# Altium schematic sheet Optical_RX_TX.SchDoc
size A4; CompanyName: Technische Hochschule Nürnberg Georg Simon Ohm; Organization: UltraZohm; Address1: Kesslerplatz 12; Address2: 90489 Nürnberg; Address3: GERMANY; DocumentNumber: 5; SheetNumber: 4; SheetTotal: 5; Website: www.ultrazohm.com
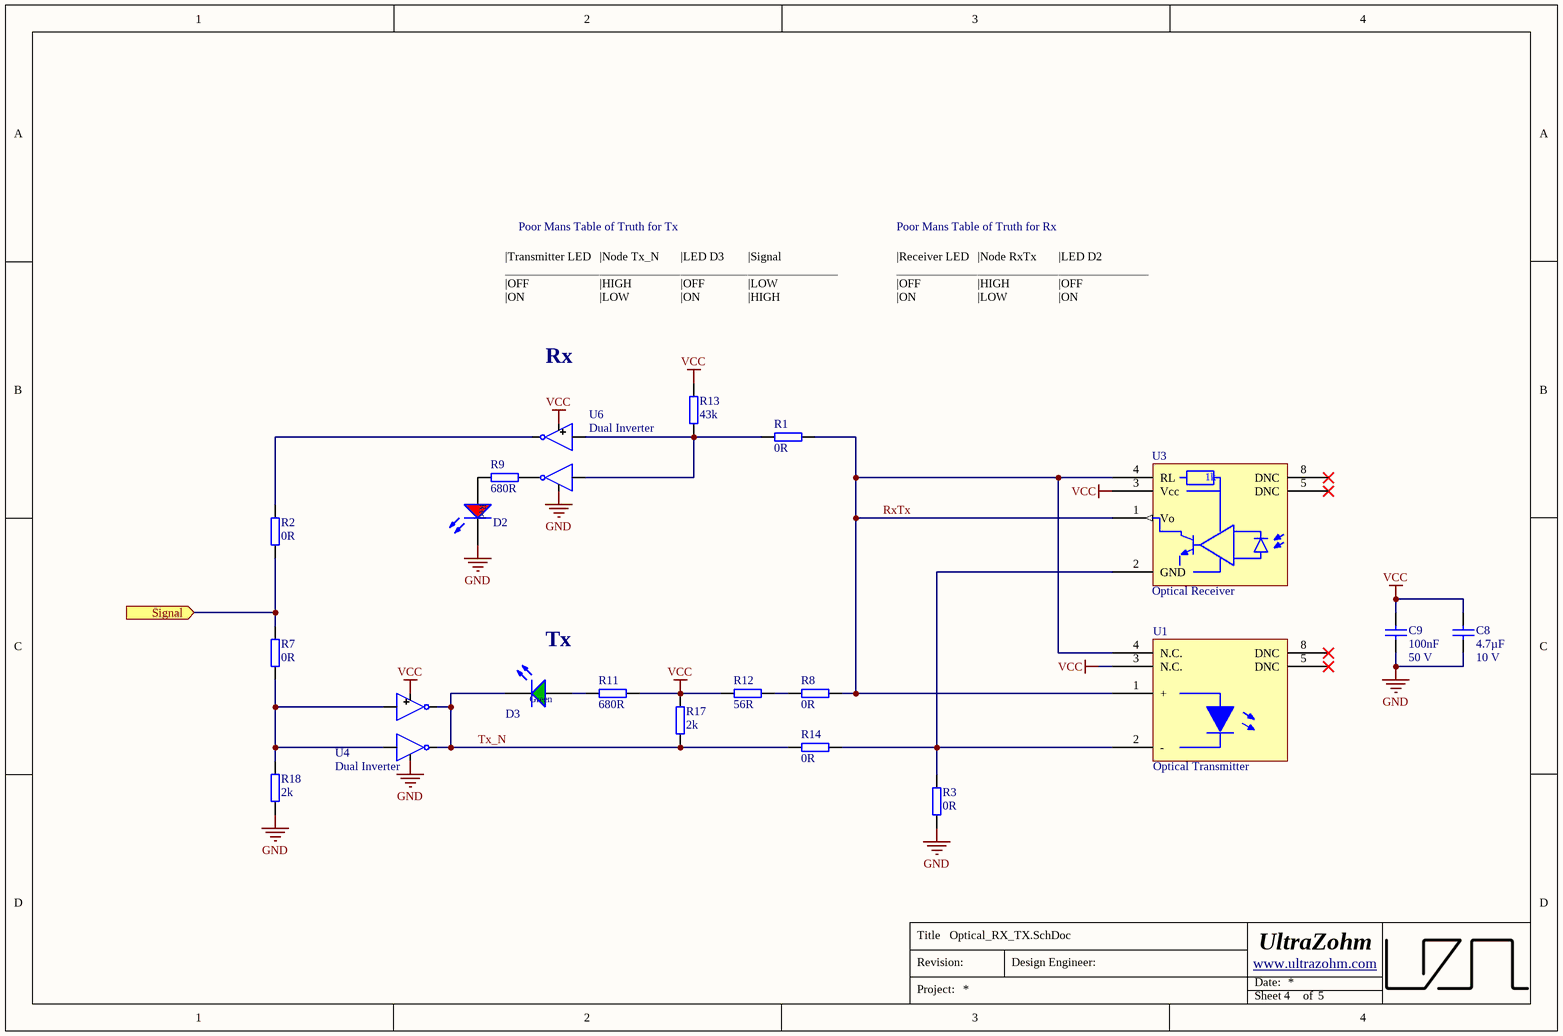
[diagram p0: Optical_RX_TX.SchDoc]

## Parts
C8  Voltage: 10 V  [CAP_2012X06N]  (hidden comment: 4.7µF)
C9  Rated Voltage: 50 V  [C_0603(1608)100_L]  (hidden comment: 100nF)
D2  150060RS75000  [WL-SMCW_0603]  (value not drawn)
D3  150060GS75000  [WL-SMCW_0603]  (value not drawn)
R1  0R  [R_0603_N]
R2  0R  [R_0603_N]
R3  0R  [R_0603_N]
R7  0R  [R_0603_N]
R8  0R  [R_0603_N]
R9  680R  [R_0603_N]
R11  680R  [R_0603_N]
R12  56R  [RES_2012X06N]
R13  43k  [R_0603_N]
R14  0R  [R_0603_N]
R17  2k  [R_0603_N]
R18  2k  [R_0603_N]
U1  Optical Transmitter  [HFBRx5XX]
U3  Optical Receiver  [HFBRx5XX]
U4  Dual Inverter  [SN74LVC2GU04DCKR]
U6  Dual Inverter  [SN74LVC2GU04DCKR]

## Ports
Signal (in)

## Nets
GND: C8.2 C9.2 D2.1(K) R3.2 R18.1 U4.2(GND) U6.2(GND)
VCC: C8.1 C9.1 R11.1 R12.1 R13.1 R17.2 U1.3(N.C.) U3.3(Vcc) U4.5(VCC) U6.5(VCC)
RxTx: R1.2 R8.2 U1.1(+) U1.4(N.C.) U3.1(Vo) U3.4(RL)
Signal: R2.1 R7.2 ; port Signal
Tx_N: D3.1(K) R14.1 R17.1 U4.4(OUT2) U4.6(OUT2)
NetD2_2: D2.2(A) R9.2
NetD3_2: D3.2(A) R11.2
NetR1_1: R1.1 R13.2 U6.1(IN1) U6.3(IN2)
NetR2_2: R2.2 U6.6(OUT2)
NetR3_1: R3.1 R14.2 U1.2(-) U3.2(GND)
NetR7_1: R7.1 R18.2 U4.1(IN1) U4.3(IN2)
NetR8_1: R8.1 R12.2
NetR9_1: R9.1 U6.4(OUT2)

Not connected (* = marked no-connect by the designer): U1 5(DNC)* 8(DNC)*; U3 5(DNC)* 8(DNC)*

## Notes on the sheet
- Poor Mans Table of Truth for Tx
- Poor Mans Table of Truth for Rx
- |Transmitter LED
  _________________
  |OFF
  |ON
- |Node Tx_N
  _________________
  |HIGH
  |LOW
- |LED D3
  _______________
  |OFF
  |ON
- GATE
  _______
  LOW
  HIGH
- |Signal
  _______________
  |LOW
  |HIGH
- |Receiver LED
  ________________
  |OFF
  |ON
- |Node RxTx
  _________________
  |HIGH
  |LOW
- |LED D2
  _______________
  |OFF
  |ON
- Rx
- Tx
- Title
- Revision:
- Design Engineer:
- Date:
- Project:
- Sheet
- of
- (in symbol HFBR-2528Z) 1k

## Library data of the parts
C8 = C_0805: CAP 0805 (2012 Metric) SMD; MPN: LMF212B7475KGHT; Tolerance: ±10%; Case-Metric: 2012; Dielectric: X7R; MF: Taiyo Yuden; Case-EIA: 0805; Max Thickness: 1 mm; Technology: SMT; Created: 2018_09_06_AGeiger; Supplier 1: Mouser; Supplier Part Number 1: 963-LMF212B7475KGHT; Value: 4.7µF; Package: 0805; LCSC Part #: C1779
C9 = C_0603: CAP 0603 (1608 Metric) SMD; Tolerance: ±5%; Case-Metric: 1608; Case-EIA: 0603; Max Thickness: 1 mm; Technology: SMT; Created: 2018_09_06_AGeiger; Dielectric: *; Supplier 1: *; Supplier Part Number 1: *; MF: *; MPN: *; Value: 100nF; Package: 0603; LCSC Part #: C14663
D2 = LED_Red_0603: WL-SMCW SMD Mono-color Chip LED Waterclear, size 0603, Red, 2 V, 140°; Forward Voltage: 2 V; Luminous Intensity: 250 mcd; Peak Wavelength: 630 nm; Dominant Wavelength: 625 nm; MF: Wuerth Elektronik; Published Date: Sep. 2017; ComponentLink1Description: Manufacturer; ComponentLink1URL: http://www.we-online.de; ComponentLink2Description: Datasheet; ComponentLink2URL: http://katalog.we-online.com/led/datasheet/150060RS75000.pdf; MPN: 150060RS75000; Size: 0603; Viewing Angle: 140°; Emitting Color: Red; Value: 150060RS75000; Package: 0603; Created: 2018_09_06_AGeiger; Supplier 1: Farnell; Supplier Part Number 1: 2322071; Supplier 2: Mouser; Supplier Part Number 2: 710-150060RS75000; Supplier 3: Digi-Key; Supplier Part Number 3: 732-4978-1-ND; LCSC Part #: C2286
D3 = LED_Green_0603: WL-SMCW SMD Mono-color Chip LED Waterclear, size 0603, Green, 3.2 V, 140°; Forward Voltage: 3.2 V; Luminous Intensity: 430 mcd; Peak Wavelength: 515 nm; Dominant Wavelength: 520 nm; MF: Wuerth Elektronik; Published Date: Sep. 2017; ComponentLink1Description: Manufacturer; ComponentLink1URL: http://www.we-online.de; ComponentLink2Description: Datasheet; ComponentLink2URL: http://katalog.we-online.com/led/datasheet/150060GS75000.pdf; MPN: 150060GS75000; Size: 0603; Viewing Angle: 140°; Emitting Color: Green; Value: 150060GS75000; Package: 0603; Created: 2018_09_06_AGeiger; Supplier 1: Farnell; Supplier Part Number 1: 2322070; Supplier 2: Mouser; Supplier Part Number 2: 710-150060GS75000; Supplier 3: Digi-Key; Supplier Part Number 3: 732-4971-1-ND; LCSC Part #: C965804
R1 R2 R7 R8 R14 = R_0603_JLC: SMD Resistor 0603; Tolerance: 1%; Voltage: 75V; Power: 100 mW; Package: 0603; Value: 0R; Created: 2018_09_06_AGeiger; Supplier 1: Mouser; Supplier Part Number 1: 71-CRCW06030000Z0EBC; LCSC Part #: C21189
R3 = R_0603: SMD Resistor 0603; MPN: CRCW06030000Z0EBC; Tolerance: 1%; Voltage: 75V; Power: 100 mW; MF: Vishay; Package: 0603; Value: 0R; Created: 2018_09_06_AGeiger; Supplier 1: Mouser; Supplier Part Number 1: 71-CRCW06030000Z0EBC; LCSC Part #: C21189
R9 R11 = R_0603: SMD Resistor 0603; MPN: CR0603-FX-3901ELF; Tolerance: 1%; Voltage: 75V; Power: 100 mW; MF: Bourns; Package: 0603; Value: 680R; Created: 2018_09_06_AGeiger; Supplier 1: Mouser; Supplier Part Number 1: 652-CR0603-FX3901ELF; LCSC Part #: C23228
R12 = R_0805: SMD Resistor 0805; MPN: CR0805-FX-1200ELF; Case_EIA: 0805; MF: Bourns; Voltage: 150 V; Power: 125 mW; Tolerance: 1%; Value: 56R; Supplier 1: Mouser; Supplier Part Number 1: 652-CR0805FX-1200ELF*; LCSC Part #: C17437
R13 = R_0603_JLC: SMD Resistor 0603; Tolerance: 1%; Voltage: 50V; Power: 100 mW; Package: 0603; Value: 43k; Created: 2018_09_06_AGeiger; Supplier 1: *; Supplier Part Number 1: *; LCSC Part #: C23172
R17 R18 = R_0603: SMD Resistor 0603; MPN: RC0603FR-072KL; Tolerance: 1%; Voltage: 75 V; Power: 100 mW; MF: Yageo; Package: 0603; Value: 2k; Created: 2018_09_06_AGeiger; Supplier 1: Mouser; Supplier Part Number 1: 603-RC0603FR-072KL; LCSC Part #: C22975
U1 = HFBR-1521Z: Fibre Optic Transmitters, Link Horiz 5MBd Tx RoHS; MF: Broadcom/Avago; Wavelength: 660 nm; Foreward Current: 60 mA; Supply Voltage: 5V; Created: 2019_04_09_Kreppel; MPN: HFBR-1521Z; Data Rate: 5 MBd; Supplier 1: Mouser; Supplier 2: Digi-Key; Supplier Part Number 1: 630-HFBR-1521Z; Supplier Part Number 2: 516-2043-ND
U3 = HFBR-2528Z: Fibre Optic Receivers, LINK HORIZ 5MBd RC VR RoHS; MPN: HFBR-2521Z; Suppier Part Number 2: 516-2062-ND; MF: Boadcom/Avago; Wavelength: 660 nm; Iout max: 25 mA; Supply Voltage: 5V; Created: 2019_04_09_Kreppel; Data Rate: 5 MBd; Supplier 1: Mouser; Supplier 2: Digi-Key; Supplier Part Number 1: 630-HFBR-2521Z
U4 U6 = SN74LVC2GU04DCKR: This dual inverter is designed for 1.65-V to 5.5-V VCC / operation.; LCSC Part #: C116660; JLCSMT Rotation: 180